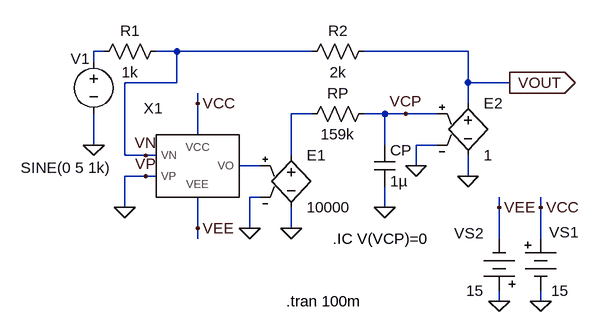
[diagram p0: schematic fig-02-03-33(b).asc]
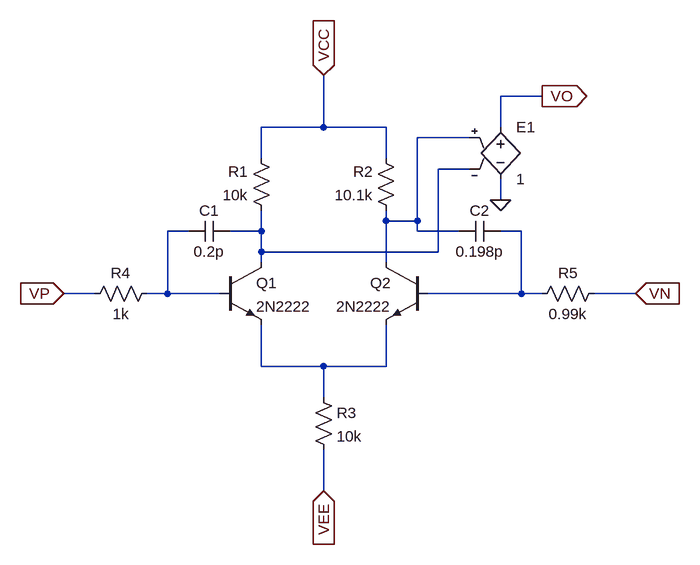
[diagram p1: sub-circuit fig-02-03-33-sub.asc]
fig-02-03-33(b).asc, the LTspice schematic file:
Version 4
SHEET 1 1740 680
WIRE -16 -32 -32 -32
WIRE 96 -32 64 -32
WIRE 304 -32 96 -32
WIRE 544 -32 384 -32
WIRE -32 -16 -32 -32
WIRE 96 16 96 -32
WIRE 96 16 16 16
WIRE 544 16 544 -32
WIRE 608 16 544 16
WIRE 128 48 128 32
WIRE 544 48 544 16
WIRE 304 64 272 64
WIRE 416 64 384 64
WIRE 448 64 416 64
WIRE 496 64 448 64
WIRE 128 96 128 48
WIRE -32 112 -32 64
WIRE 416 112 416 64
WIRE 496 112 464 112
WIRE 16 128 16 16
WIRE 48 128 16 128
WIRE 64 128 48 128
WIRE 272 128 272 64
WIRE 224 144 192 144
WIRE 464 144 464 112
WIRE 48 160 16 160
WIRE 64 160 48 160
WIRE 544 160 544 128
WIRE 224 192 208 192
WIRE 16 208 16 160
WIRE 416 208 416 176
WIRE 592 208 592 192
WIRE 656 208 656 192
WIRE 128 240 128 192
WIRE 208 240 208 192
WIRE 272 240 272 208
WIRE 128 256 128 240
WIRE 592 256 592 208
WIRE 656 256 656 208
WIRE 592 352 592 336
WIRE 656 352 656 336
FLAG -32 112 0
FLAG 416 208 0
FLAG 464 144 0
FLAG 544 160 0
FLAG 608 16 VOUT
IOPIN 608 16 Out
FLAG 592 352 0
FLAG 656 352 0
FLAG 592 208 VEE
FLAG 656 208 VCC
FLAG 128 48 VCC
FLAG 128 240 VEE
FLAG 16 208 0
FLAG 448 64 VCP
FLAG 48 160 VP
FLAG 48 128 VN
FLAG 272 240 0
FLAG 208 240 0
SYMBOL voltage -32 -32 R0
WINDOW 123 24 124 Left 2
WINDOW 39 0 0 Left 0
WINDOW 3 -112 179 Left 2
WINDOW 0 -35 11 Left 2
SYMATTR Value SINE(0 5 1k)
SYMATTR InstName V1
SYMBOL res 400 48 R90
WINDOW 0 0 56 VBottom 2
WINDOW 3 32 56 VTop 2
SYMATTR InstName RP
SYMATTR Value 159k
SYMBOL cap 400 112 R0
SYMATTR InstName CP
SYMATTR Value 1µ
SYMBOL e 544 32 R0
SYMATTR InstName E2
SYMATTR Value 1
SYMBOL Misc\\battery 656 240 R0
WINDOW 0 13 6 Left 2
WINDOW 3 16 96 Left 2
SYMATTR InstName VS1
SYMATTR Value 15
SYMBOL Misc\\battery 592 352 R180
WINDOW 0 24 104 Left 2
WINDOW 3 24 16 Left 2
SYMATTR InstName VS2
SYMATTR Value 15
SYMBOL res 80 -48 R90
WINDOW 0 0 56 VBottom 2
WINDOW 3 32 56 VTop 2
SYMATTR InstName R1
SYMATTR Value 1k
SYMBOL res 400 -48 R90
WINDOW 0 0 56 VBottom 2
WINDOW 3 32 56 VTop 2
SYMATTR InstName R2
SYMATTR Value 2k
SYMBOL e 272 112 R0
SYMATTR InstName E1
SYMATTR Value 10000
SYMBOL fig-02-03-33-sub 128 144 R0
WINDOW 0 -68 -73 Bottom 2
SYMATTR InstName X1
TEXT 336 256 Left 2 !.IC V(VCP)=0
TEXT 264 352 Left 2 !.tran 100m

fig-02-03-33-sub.asc, the sub-circuit schematic file:
Version 4
SHEET 1 1040 692
WIRE -64 -256 -128 -256
WIRE -400 -208 -400 -288
WIRE -400 -208 -496 -208
WIRE -304 -208 -400 -208
WIRE -128 -208 -128 -256
WIRE -176 -192 -256 -192
WIRE -496 -160 -496 -208
WIRE -304 -160 -304 -208
WIRE -176 -144 -224 -144
WIRE -128 -96 -128 -128
WIRE -304 -64 -304 -80
WIRE -256 -64 -256 -192
WIRE -256 -64 -304 -64
WIRE -608 -48 -640 -48
WIRE -496 -48 -496 -80
WIRE -496 -48 -544 -48
WIRE -256 -48 -256 -64
WIRE -192 -48 -256 -48
WIRE -96 -48 -128 -48
WIRE -496 -16 -496 -48
WIRE -224 -16 -224 -144
WIRE -224 -16 -496 -16
WIRE -496 0 -496 -16
WIRE -304 0 -304 -64
WIRE -752 48 -800 48
WIRE -640 48 -640 -48
WIRE -640 48 -672 48
WIRE -560 48 -640 48
WIRE -96 48 -96 -48
WIRE -96 48 -240 48
WIRE -64 48 -96 48
WIRE 80 48 16 48
WIRE -496 160 -496 96
WIRE -400 160 -496 160
WIRE -304 160 -304 96
WIRE -304 160 -400 160
WIRE -400 208 -400 160
WIRE -400 352 -400 288
FLAG -64 -256 VO
IOPIN -64 -256 Out
FLAG -400 352 VEE
IOPIN -400 352 In
FLAG -400 -288 VCC
IOPIN -400 -288 In
FLAG -800 48 VP
IOPIN -800 48 In
FLAG 80 48 VN
IOPIN 80 48 In
FLAG -128 -96 0
SYMBOL res -480 -64 R180
WINDOW 0 36 76 Left 2
WINDOW 3 36 40 Left 2
SYMATTR InstName R1
SYMATTR Value 10k
SYMBOL npn -560 0 R0
SYMATTR InstName Q1
SYMATTR Value 2N2222
SYMBOL npn -240 0 M0
SYMATTR InstName Q2
SYMATTR Value 2N2222
SYMBOL res -288 -64 R180
WINDOW 0 36 76 Left 2
WINDOW 3 36 40 Left 2
SYMATTR InstName R2
SYMATTR Value 10.1k
SYMBOL res -416 192 R0
SYMATTR InstName R3
SYMATTR Value 10k
SYMBOL e -128 -224 R0
SYMATTR InstName E1
SYMATTR Value 1
SYMBOL cap -544 -64 R90
WINDOW 0 0 32 VBottom 2
WINDOW 3 32 32 VTop 2
SYMATTR InstName C1
SYMATTR Value 0.2p
SYMBOL cap -128 -64 R90
WINDOW 0 0 32 VBottom 2
WINDOW 3 32 32 VTop 2
SYMATTR InstName C2
SYMATTR Value 0.198p
SYMBOL res -656 32 R90
WINDOW 0 0 56 VBottom 2
WINDOW 3 32 56 VTop 2
SYMATTR InstName R4
SYMATTR Value 1k
SYMBOL res 32 32 R90
WINDOW 0 0 56 VBottom 2
WINDOW 3 32 56 VTop 2
SYMATTR InstName R5
SYMATTR Value 0.99k

The netlist it stands for:
* fig-02-03-33(b).asc
V1 N001 0 SINE(0 5 1k)
RP VCP N002 159k
CP VCP 0 1µ
E2 VOUT 0 VCP 0 1
VS1 VCC 0 15
VS2 0 VEE 15
R1 VN N001 1k
R2 VOUT VN 2k
E1 N002 0 N003 0 10000
XX1 VCC VEE VN 0 N003 fig-02-03-33-sub

* block symbol definitions
.subckt fig-02-03-33-sub VCC VEE VN VP VO
R1 N002 VCC 10k
Q1 N002 N003 N005 0 2N2222
Q2 N001 N004 N005 0 2N2222
R2 N001 VCC 10.1k
R3 N005 VEE 10k
E1 VO 0 N001 N002 1
C1 N002 N003 0.2p
C2 N004 N001 0.198p
R4 N003 VP 1k
R5 VN N004 0.99k
.ends fig-02-03-33-sub

.model NPN NPN
.model PNP PNP
.lib standard.bjt
.IC V(VCP)=0
.tran 100m
.backanno
.end